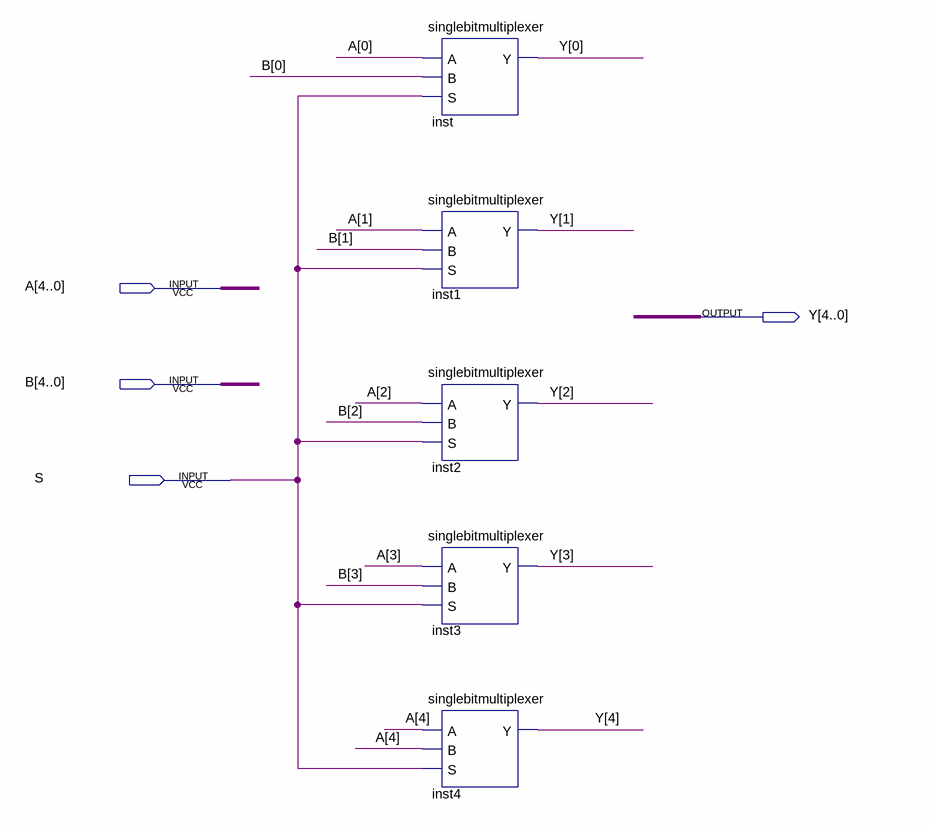
[diagram p0: schematic sheet]
// Quartus schematic fivebitmultiplexer.bdf as structural Verilog: 5 symbols, 4 pins
module fivebitmultiplexer (
  input  [4:0] A,
  input  [4:0] B,
  input  S,
  output [4:0] Y
);

  singlebitmultiplexer inst (.A(A[0]), .B(B[0]), .S(S), .Y(Y[0]));
  singlebitmultiplexer inst1 (.A(A[1]), .B(B[1]), .S(S), .Y(Y[1]));
  singlebitmultiplexer inst2 (.A(A[2]), .B(B[2]), .S(S), .Y(Y[2]));
  singlebitmultiplexer inst3 (.A(A[3]), .B(B[3]), .S(S), .Y(Y[3]));
  singlebitmultiplexer inst4 (.A(A[4]), .B(A[4]), .S(S), .Y(Y[4]));
endmodule
